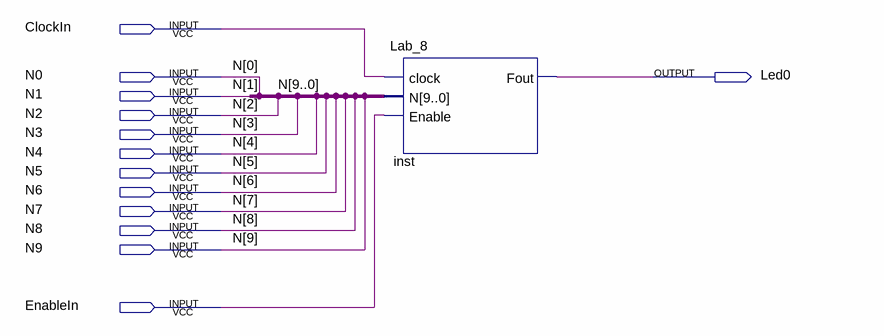
[diagram p0: schematic sheet]
// Quartus schematic Block3.bdf as structural Verilog: 1 symbols, 13 pins
module Block3 (
  input  ClockIn,
  input  N0,
  input  N1,
  input  N2,
  input  N3,
  input  N4,
  input  N5,
  input  N6,
  input  N7,
  input  N8,
  input  N9,
  input  EnableIn,
  output Led0
);

  Lab_8 inst (.clock(ClockIn), .N({N9, N8, N7, N6, N5, N4, N3, N2, N1, N0}), .Enable(EnableIn), .Fout(Led0));
endmodule
